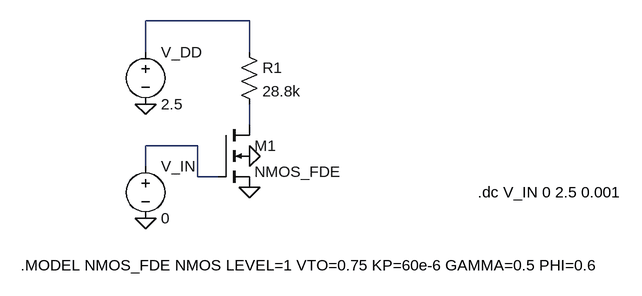
[diagram p0: schematic inverter.asc]
inverter.asc, the LTspice schematic file:
Version 4
SHEET 1 1064 680
WIRE 240 16 80 16
WIRE 80 64 80 16
WIRE 240 64 240 16
WIRE 240 176 240 144
WIRE 160 208 80 208
WIRE 80 240 80 208
WIRE 160 256 160 208
WIRE 192 256 160 256
FLAG 80 320 0
FLAG 80 144 0
FLAG 240 272 0
FLAG 240 224 0
SYMBOL nmos4 192 176 R0
SYMATTR InstName M1
SYMATTR Value NMOS_FDE
SYMATTR Value2 l=1u w=2.22u
SYMBOL voltage 80 48 R0
SYMATTR InstName V_DD
SYMATTR Value 2.5
SYMATTR SpiceLine Rser=0
SYMBOL voltage 80 224 R0
SYMATTR InstName V_IN
SYMATTR Value 0
SYMATTR SpiceLine Rser=0
SYMBOL Res 224 48 R0
SYMATTR InstName R1
SYMATTR Value 28.8k
TEXT -112 392 Left 2 !.MODEL NMOS_FDE NMOS LEVEL=1 VTO=0.75 KP=60e-6 GAMMA=0.5 PHI=0.6
TEXT 592 280 Left 2 !.dc V_IN 0 2.5 0.001

The netlist it stands for:
* inverter.asc
M1 N002 N003 0 0 NMOS_FDE l=1u w=2.22u
V_DD N001 0 2.5 Rser=0
V_IN N003 0 0 Rser=0
R1 N001 N002 28.8k
.model NMOS NMOS
.model PMOS PMOS
.lib standard.mos
.MODEL NMOS_FDE NMOS LEVEL=1 VTO=0.75 KP=60e-6 GAMMA=0.5 PHI=0.6
.dc V_IN 0 2.5 0.001
.backanno
.end